# Altium project Project2_ESP_LoRA.PrjPcb
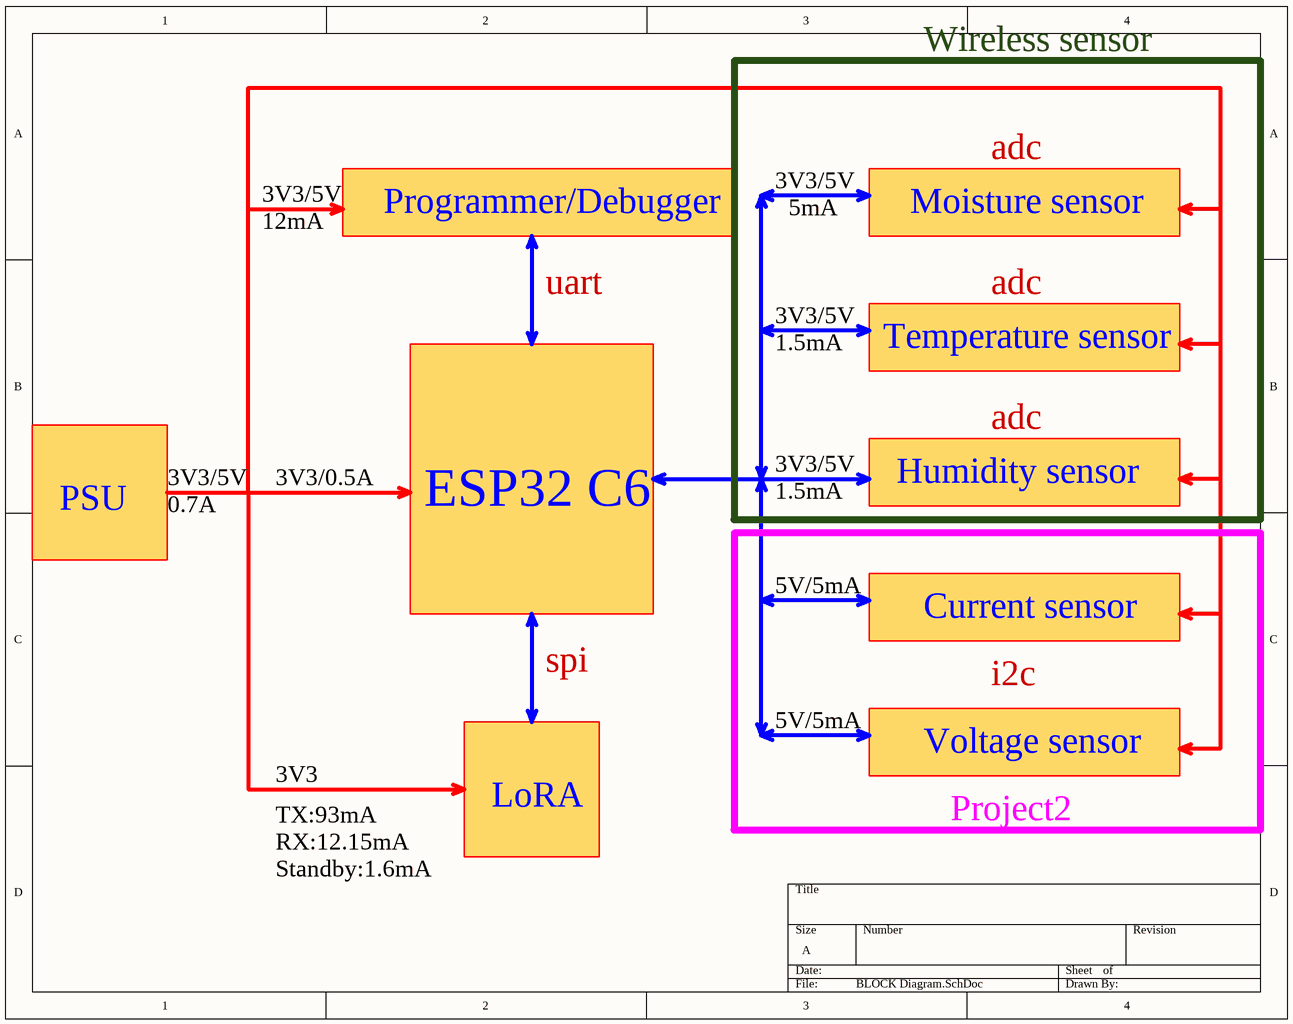
[diagram p0: BLOCK Diagram.SchDoc]
5 sheets, 28 parts. Net scope: flat (ports and power ports of the same name join across sheets).
Board file: Project2_ESP_LoRA.PcbDoc
Sheets:
  BLOCK Diagram.SchDoc
  ESP32_C6_Schematic.SchDoc
  Programmer_Debugger.SchDoc
  Sensor_Schematic.SchDoc
  LoRA_RA02.SchDoc

## Sheet BLOCK Diagram.SchDoc
size A; SheetNumber: 1; SheetTotal: 6

### Notes on the sheet
- Wireless sensor
- adc
- 3V3/5V
- 12mA
- Programmer/Debugger
- 5mA
- Moisture sensor
- uart
- 1.5mA
- Temperature sensor
- 3V3/0.5A
- Humidity sensor
- PSU
- 0.7A
- ESP32 C6
- 5V/5mA
- Current sensor
- spi
- i2c
- Voltage sensor
- 3V3
- TX:93mA
- LoRA
- Project2
- RX:12.15mA
- Standby:1.6mA

## Sheet ESP32_C6_Schematic.SchDoc
size A; SheetNumber: 2; SheetTotal: 5
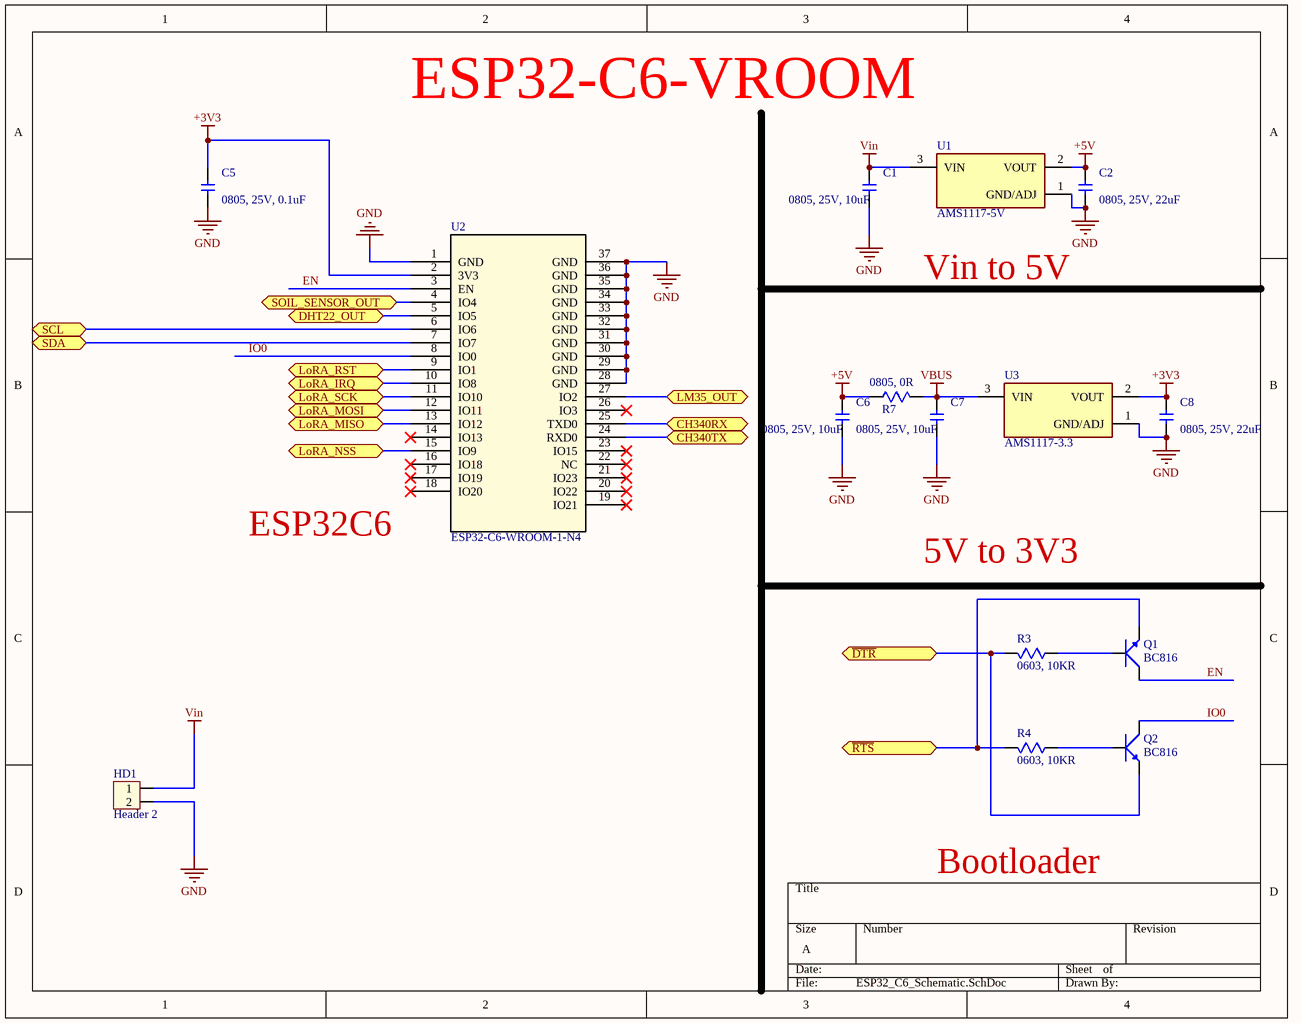
[diagram p1: ESP32_C6_Schematic.SchDoc]

### Parts
C1  0805, 25V, 10uF  [C0805]
C2  0805, 25V, 22uF  [C0805]
C5  0805, 25V, 0.1uF  [C0805]
C6  0805, 25V, 10uF  [C0805]
C7  0805, 25V, 10uF  [C0805]
C8  0805, 25V, 22uF  [C0805]
HD1  Header 2  [HED2]
Q1  BC816  [SOT95P237X111-3N]
Q2  BC816  [SOT95P237X111-3N]
R3  0603, 10KR  [RES0603]
R4  0603, 10KR  [RES0603]
R7  0805, 0R  [C0805]
U1  AMS1117-5V  [SOT229P700X180-4N]
U2  ESP32-C6-WROOM-1-N4  [MOD28_ESP32-C6-WROOM-1_EXP]
U3  AMS1117-3.3  [SOT229P700X180-4N]

### Ports
CH340RX (bidir), CH340TX (bidir), DHT22_OUT (bidir), LM35_OUT (bidir), LoRA_IRQ (bidir), LoRA_MISO (bidir), LoRA_MOSI (bidir), LoRA_NSS (bidir), LoRA_RST (bidir), LoRA_SCK (bidir), SCL (bidir), SDA (bidir), SOIL_SENSOR_OUT (bidir), ~{DTR} (bidir), ~{RTS} (bidir)

### Nets
+3V3: C5.2 C8.2 U2.2(3V3) U3.2(VOUT)
+5V: C2.2 C6.2 R7.1 U1.2(VOUT)
GND: C1.1 C2.1 C5.1 C6.1 C7.1 C8.1 HD1.2 U1.1(GND/ADJ) U2.1(GND) U2.28(GND) U2.29(GND) U2.30(GND) U2.31(GND) U2.32(GND) U2.33(GND) U2.34(GND) U2.35(GND) U2.36(GND) U2.37(GND) U3.1(GND/ADJ)
VBUS: C7.2 R7.2 U3.3(VIN)
Vin: C1.2 HD1.1 U1.3(VIN)
EN: Q1.3(C) U2.3(EN)
IO0: Q2.3(C) U2.8(IO0)
NetDHT22_02: U2.5(IO5) ; port DHT22_OUT
NetINA219_03: U2.6(IO6) ; port SCL
NetINA219_04: U2.7(IO7) ; port SDA
NetLM35_02: U2.27(IO2) ; port LM35_OUT
NetQ1_1: Q1.1(B) R3.1
NetQ1_2: Q1.2(E) R4.2 ; port ~{RTS}
NetQ2_1: Q2.1(B) R4.1
NetQ2_2: Q2.2(E) R3.2 ; port ~{DTR}
NetSOIL_SENSOR_03: U2.4(IO4) ; port SOIL_SENSOR_OUT
NetU2_9: U2.9(IO1) ; port LoRA_RST
NetU2_10: U2.10(IO8) ; port LoRA_IRQ
NetU2_11: U2.11(IO10) ; port LoRA_SCK
NetU2_12: U2.12(IO11) ; port LoRA_MOSI
NetU2_13: U2.13(IO12) ; port LoRA_MISO
NetU2_15: U2.15(IO9) ; port LoRA_NSS
NetU2_24: U2.24(RXD0) ; port CH340TX
NetU2_25: U2.25(TXD0) ; port CH340RX

Not connected (* = marked no-connect by the designer): U2 14(IO13)* 16(IO18)* 17(IO19)* 18(IO20)* 19(IO21)* 20(IO22)* 21(IO23)* 22(NC)* 23(IO15)* 26(IO3)*

### Notes on the sheet
- ESP32-C6-VROOM
- Vin to 5V
- ESP32C6
- 5V to 3V3
- Bootloader

### Library data of the parts
C1 C2 C5-C8 = C0805: Part Number: *; MFR: *
HD1 = Hed2: Header 2 (Green); Value: Header 2
Q1 Q2 = BC816: Transistor NPN 45V 0.5A hfe160 SOT23 | ON Semiconductor BC817-25LT1G; SnapEDA_Link: https://www.snapeda.com/parts/BC817-25LT1G/Onsemi/view-part/?ref=snap; Package: SOT-23-3 ON Semiconductor; Value: *; MF: ON Semiconductor; MP: BC817-25LT1G; Check_prices: https://www.snapeda.com/parts/BC817-25LT1G/Onsemi/view-part/?ref=eda
R3 R4 = R0603: Part Number: *; MFR: *
R7 = R0805: Part Number: *; MFR: *
U1 = AMS1117-5V: Sot223/Pkg 1-Amp 5V-Volt Low Drop Out Voltage Regulatator; MF: Advanced Monolithic Systems; MP: AMS1117-3.3; SnapEDA_Link: https://www.snapeda.com/parts/AMS1117-3.3/Advanced+Monolithic+Systems/view-part/?ref=snap; Package: SOT-223 Seeed Technology; Value: *; Check_prices: https://www.snapeda.com/parts/AMS1117-3.3/Advanced+Monolithic+Systems/view-part/?ref=eda
U2 = ESP32-C6-WROOM-1-N4: Description; Manufacturer_Name: Espressif Systems; Type: RF; Copyright: Copyright (C) 2025 Ultra Librarian. All rights reserved.; Manufacturer_Part_Number: ESP32-C6-WROOM-1-N4; RefDes: RefDes
U3 = AMS1117-3.3: Sot223/Pkg 1-Amp 3.3-Volt Low Drop Out Voltage Regulatator; MF: Advanced Monolithic Systems; SnapEDA_Link: https://www.snapeda.com/parts/AMS1117-3.3/Advanced+Monolithic+Systems/view-part/?ref=snap; Package: SOT-223 Seeed Technology; Value: *; MP: AMS1117-3.3; Check_prices: https://www.snapeda.com/parts/AMS1117-3.3/Advanced+Monolithic+Systems/view-part/?ref=eda

## Sheet Programmer_Debugger.SchDoc
size A; SheetNumber: 3; SheetTotal: 5
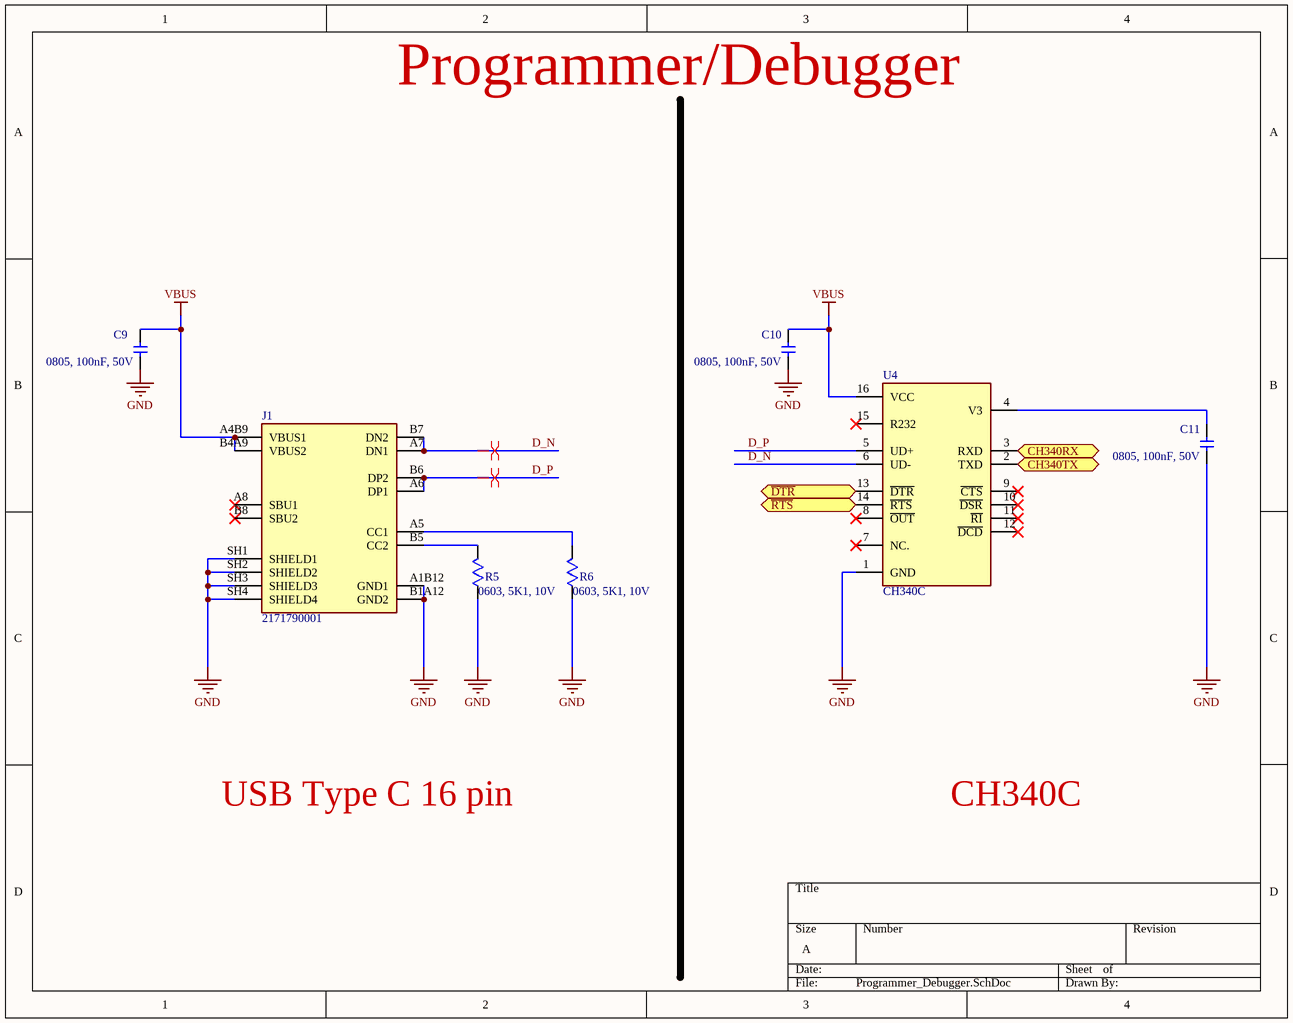
[diagram p2: Programmer_Debugger.SchDoc]

### Parts
C9  0805, 100nF, 50V  [C0805]
C10  0805, 100nF, 50V  [C0805]
C11  0805, 100nF, 50V  [C0805]
J1  2171790001  [MOLEX_2171790001]
R5  0603, 5K1, 10V  [RES0603]
R6  0603, 5K1, 10V  [RES0603]
U4  CH340C  [SOIC127P600X180-16N]

### Ports
CH340RX (bidir), CH340TX (bidir), ~{DTR} (bidir), ~{RTS} (bidir)

### Nets
GND: C9.1 C10.1 C11.1 J1.A1B12(GND1) J1.B1A12(GND2) J1.SH1(SHIELD1) J1.SH2(SHIELD2) J1.SH3(SHIELD3) J1.SH4(SHIELD4) R5.1 R6.1 U4.1(GND)
VBUS: C9.2 C10.2 J1.A4B9(VBUS1) J1.B4A9(VBUS2) U4.16(VCC)
D_N: J1.A7(DN1) J1.B7(DN2) U4.6(UD-)
D_P: J1.A6(DP1) J1.B6(DP2) U4.5(UD+)
NetC11_2: C11.2 U4.4(V3)
NetJ1_A5: J1.A5(CC1) R6.2
NetJ1_B5: J1.B5(CC2) R5.2
NetQ1_2: U4.14(~{RTS}) ; port ~{RTS}
NetQ2_2: U4.13(~{DTR}) ; port ~{DTR}
NetU2_24: U4.2(TXD) ; port CH340TX
NetU2_25: U4.3(RXD) ; port CH340RX

Not connected (* = marked no-connect by the designer): J1 A8(SBU1)* B8(SBU2)*; U4 7(NC.)* 8(~{OUT})* 9(~{CTS})* 10(~{DSR})* 11(~{RI})* 12(~{DCD})* 15(R232)*

### Layout directives
differential pair; differential pair class diff90: D_N, D_P

### Notes on the sheet
- Programmer/Debugger
- USB Type C 16 pin
- CH340C

### Library data of the parts
C9-C11 = C0805: Part Number: *; MFR: *
J1 = 2171790001: USB Type C - Connector, Top-mount SMT, 16pos | Molex Incorporated 217179-0001; SnapEDA_Link: https://www.snapeda.com/parts/217179-0001/Molex/view-part/?ref=snap; Package: None; Value: *; MF: Molex; MP: 217179-0001; Check_prices: https://www.snapeda.com/parts/217179-0001/Molex/view-part/?ref=eda
R5 R6 = R0603: Part Number: *; MFR: *
U4 = CH340C: USB to serial chip CH340; MF: WCH; Price: None; Availability: Not in stock; MP: CH340C; Package: None; SnapEDA_Link: https://www.snapeda.com/parts/CH340C/WCH/view-part/?ref=snap; Check_prices: https://www.snapeda.com/parts/CH340C/WCH/view-part/?ref=eda; Value: *

## Sheet Sensor_Schematic.SchDoc
size A; SheetNumber: 4; SheetTotal: 5
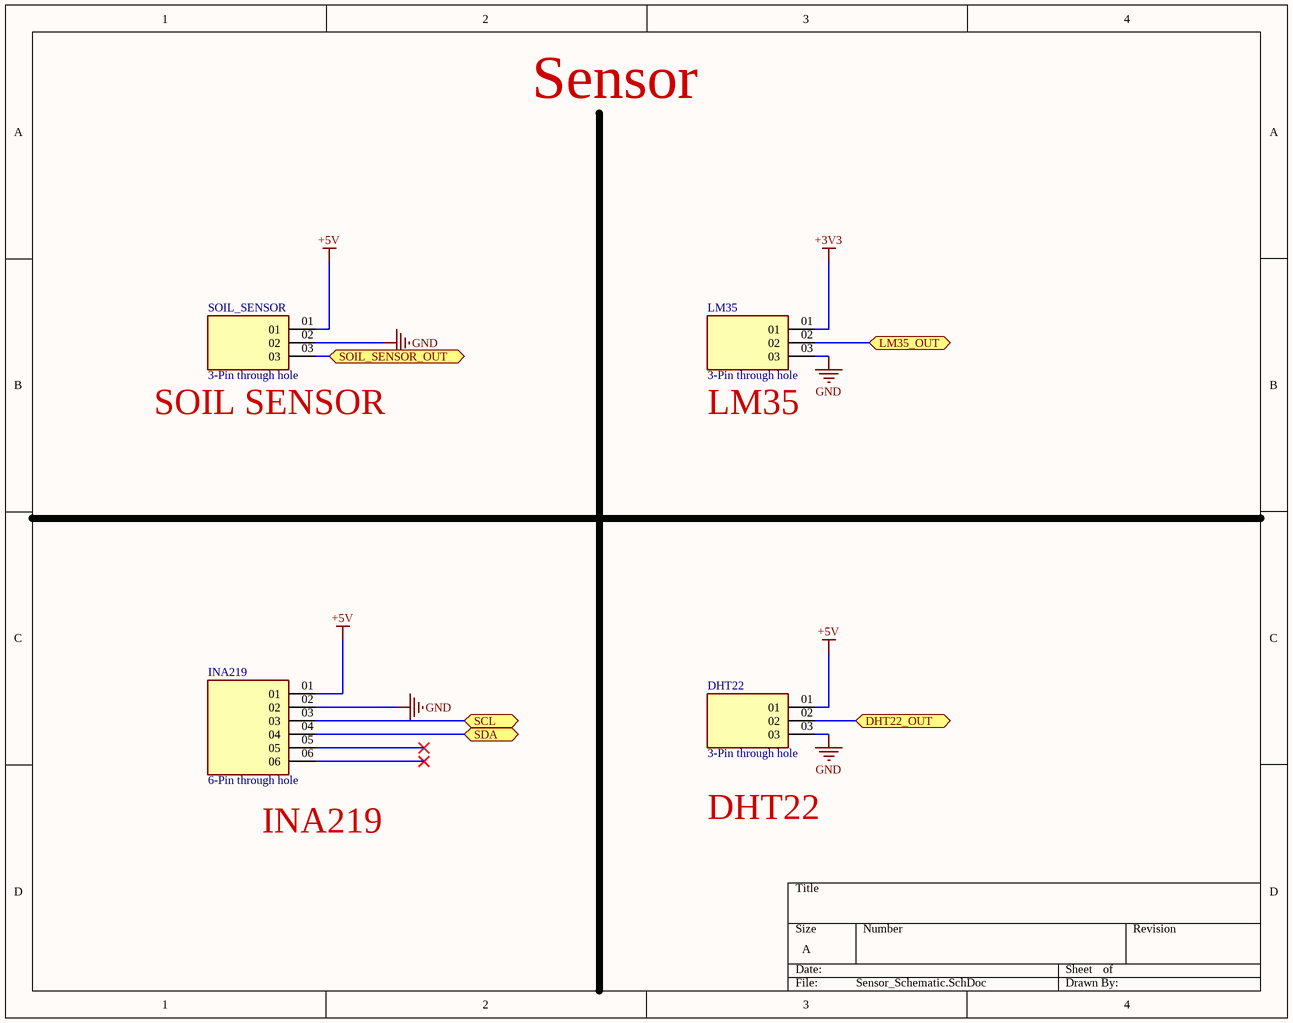
[diagram p3: Sensor_Schematic.SchDoc]

### Parts
DHT22  3-Pin through hole  [SAMTEC_MTSW-101-08-G-T-240]
INA219  6-Pin through hole  [SAMTEC_MTSW-106-22-G-S-235 - duplicate1]
LM35  3-Pin through hole  [SAMTEC_MTSW-101-08-G-T-240]
SOIL_SENSOR  3-Pin through hole  [SAMTEC_MTSW-101-08-G-T-240]

### Ports
DHT22_OUT (bidir), LM35_OUT (bidir), SCL (bidir), SDA (bidir), SOIL_SENSOR_OUT (bidir)

### Nets
+3V3: LM35.01
+5V: DHT22.01 INA219.01 SOIL_SENSOR.01
GND: DHT22.03 INA219.02 LM35.03 SOIL_SENSOR.02
NetDHT22_02: DHT22.02 ; port DHT22_OUT
NetINA219_03: INA219.03 ; port SCL
NetINA219_04: INA219.04 ; port SDA
NetLM35_02: LM35.02 ; port LM35_OUT
NetSOIL_SENSOR_03: SOIL_SENSOR.03 ; port SOIL_SENSOR_OUT

Not connected (* = marked no-connect by the designer): INA219 05* 06*

### Notes on the sheet
- Sensor
- (near SOIL_SENSOR) SOIL SENSOR
- (near LM35) LM35
- (near INA219) INA219
- DHT22

### Library data of the parts
DHT22 LM35 SOIL_SENSOR = 3-Pin through hole: MP: altium_native_batch; Package: None; Price: None; Value: *; Availability: Unavailable
INA219 = 6-Pin through hole: MP: MTSW-106-22-G-S-235; Price: None; Package: None; Availability: Unavailable; Value: *

## Sheet LoRA_RA02.SchDoc
size A; SheetNumber: 5; SheetTotal: 5
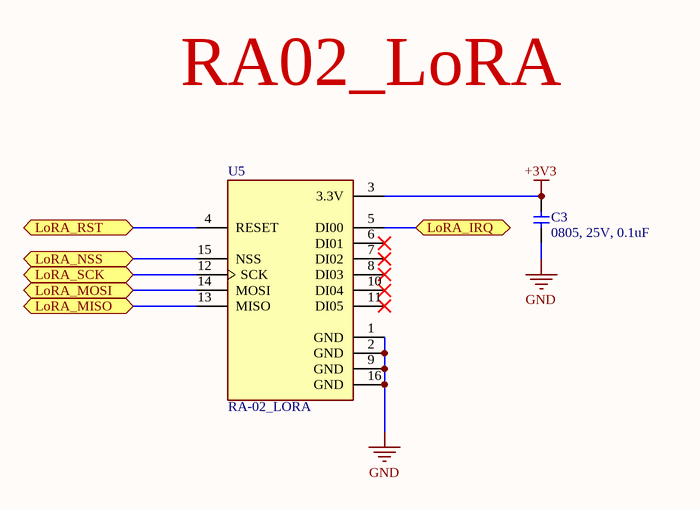
[diagram p4: LoRA_RA02.SchDoc]

### Parts
C3  0805, 25V, 0.1uF  [C0805]
U5  RA-02_LORA  [MODULE_RA-02_LORA - duplicate]

### Ports
LoRA_IRQ (bidir), LoRA_MISO (bidir), LoRA_MOSI (bidir), LoRA_NSS (bidir), LoRA_RST (bidir), LoRA_SCK (bidir)

### Nets
+3V3: C3.2 U5.3(3.3V)
GND: C3.1 U5.1(GND) U5.2(GND) U5.9(GND) U5.16(GND)
NetU2_9: U5.4(RESET) ; port LoRA_RST
NetU2_10: U5.5(DI00) ; port LoRA_IRQ
NetU2_11: U5.12(SCK) ; port LoRA_SCK
NetU2_12: U5.14(MOSI) ; port LoRA_MOSI
NetU2_13: U5.13(MISO) ; port LoRA_MISO
NetU2_15: U5.15(NSS) ; port LoRA_NSS

Not connected (* = marked no-connect by the designer): U5 6(DI01)* 7(DI02)* 8(DI03)* 10(DI04)* 11(DI05)*

### Notes on the sheet
- RA02_LoRA

### Library data of the parts
C3 = C0805: Part Number: *; MFR: *
U5 = RA-02_LORA: Ra-02 LoRa RF M5Stack Platform Evaluation Expansion Board; Price: None; Availability: Unavailable; MP: RA-02_LORA; Value: *; Package: None

## Nets that join several sheets
+3V3: ESP32_C6_Schematic (C5.2 C8.2 U2.2 U3.2), Sensor_Schematic (LM35.01), LoRA_RA02 (C3.2 U5.3)
+5V: ESP32_C6_Schematic (C2.2 C6.2 R7.1 U1.2), Sensor_Schematic (DHT22.01 INA219.01 SOIL_SENSOR.01)
GND: ESP32_C6_Schematic (20 pins), Programmer_Debugger (12 pins), Sensor_Schematic (DHT22.03 INA219.02 LM35.03 SOIL_SENSOR.02), LoRA_RA02 (5 pins)
VBUS: ESP32_C6_Schematic (C7.2 R7.2 U3.3), Programmer_Debugger (5 pins)
NetDHT22_02: ESP32_C6_Schematic (U2.5), Sensor_Schematic (DHT22.02)
NetINA219_03: ESP32_C6_Schematic (U2.6), Sensor_Schematic (INA219.03)
NetINA219_04: ESP32_C6_Schematic (U2.7), Sensor_Schematic (INA219.04)
NetLM35_02: ESP32_C6_Schematic (U2.27), Sensor_Schematic (LM35.02)
NetQ1_2: ESP32_C6_Schematic (Q1.2 R4.2), Programmer_Debugger (U4.14)
NetQ2_2: ESP32_C6_Schematic (Q2.2 R3.2), Programmer_Debugger (U4.13)
NetSOIL_SENSOR_03: ESP32_C6_Schematic (U2.4), Sensor_Schematic (SOIL_SENSOR.03)
NetU2_9: ESP32_C6_Schematic (U2.9), LoRA_RA02 (U5.4)
NetU2_10: ESP32_C6_Schematic (U2.10), LoRA_RA02 (U5.5)
NetU2_11: ESP32_C6_Schematic (U2.11), LoRA_RA02 (U5.12)
NetU2_12: ESP32_C6_Schematic (U2.12), LoRA_RA02 (U5.14)
NetU2_13: ESP32_C6_Schematic (U2.13), LoRA_RA02 (U5.13)
NetU2_15: ESP32_C6_Schematic (U2.15), LoRA_RA02 (U5.15)
NetU2_24: ESP32_C6_Schematic (U2.24), Programmer_Debugger (U4.2)
NetU2_25: ESP32_C6_Schematic (U2.25), Programmer_Debugger (U4.3)